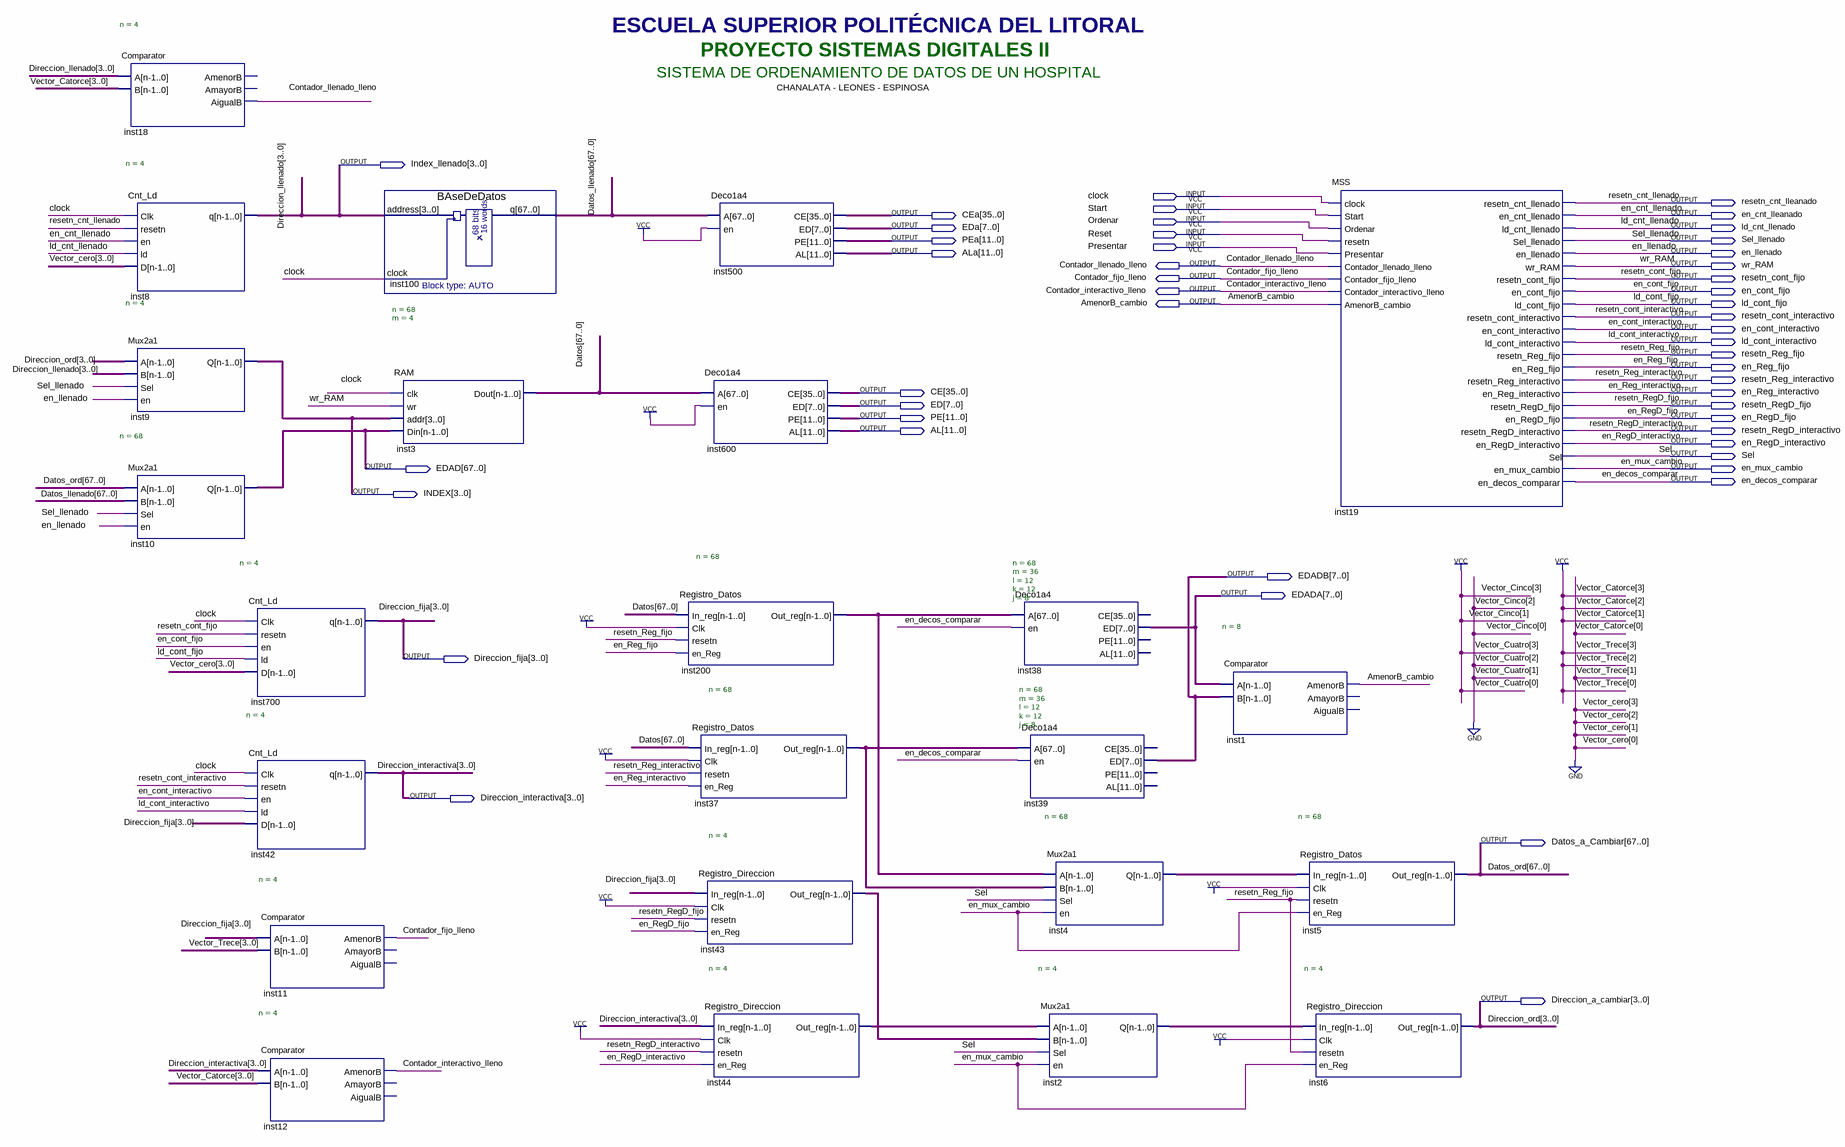
[diagram p0: schematic sheet]
// Quartus schematic PROYECTO_SD2.bdf as structural Verilog: 24 symbols, 49 pins
module PROYECTO_SD2 (
  input  clock,
  input  Start,
  input  Ordenar,
  input  Reset,
  input  Presentar,
  output [3:0] Index_llenado,
  output resetn_cnt_lleanado,
  output [35:0] CEa,
  output en_cnt_lleanado,
  output [7:0] EDa,
  output ld_cnt_llenado,
  output [11:0] PEa,
  output Sel_llenado,
  output [11:0] ALa,
  output en_llenado,
  output Contador_llenado_lleno,
  output wr_RAM,
  output Contador_fijo_lleno,
  output resetn_cont_fijo,
  output Contador_interactivo_lleno,
  output en_cont_fijo,
  output AmenorB_cambio,
  output ld_cont_fijo,
  output resetn_cont_interactivo,
  output en_cont_interactivo,
  output ld_cont_interactivo,
  output resetn_Reg_fijo,
  output en_Reg_fijo,
  output resetn_Reg_interactivo,
  output [35:0] CE,
  output en_Reg_interactivo,
  output [7:0] ED,
  output resetn_RegD_fijo,
  output [11:0] PE,
  output en_RegD_fijo,
  output [11:0] AL,
  output resetn_RegD_interactivo,
  output en_RegD_interactivo,
  output Sel,
  output [67:0] EDAD,
  output en_mux_cambio,
  output en_decos_comparar,
  output [3:0] INDEX,
  output [7:0] EDADB,
  output [7:0] EDADA,
  output [3:0] Direccion_fija,
  output [3:0] Direccion_interactiva,
  output [67:0] Datos_a_Cambiar,
  output [3:0] Direccion_a_cambiar
);

  wire [3:0] inst2_q, inst43_out_reg, inst44_out_reg;
  wire [67:0] Datos, Datos_llenado, inst4_q, inst37_out_reg, inst200_out_reg;

  Comparator #(.n(4)) inst18 (
    .A(Index_llenado), .B(4'b1110), .AigualB(Contador_llenado_lleno));  // open: AmenorB, AmayorB
  Cnt_Ld #(.n(4)) inst8 (
    .Clk(clock), .resetn(resetn_cnt_lleanado), .en(en_cnt_lleanado), .ld(ld_cnt_llenado), .D(4'b0000),
    .q(Index_llenado));
  Mux2a1 #(.n(4)) inst9 (.A(Direccion_a_cambiar), .B(Index_llenado), .Sel(Sel_llenado), .en(en_llenado), .Q(INDEX));
  Mux2a1 #(.n(68)) inst10 (.A(Datos_a_Cambiar), .B(Datos_llenado), .Sel(Sel_llenado), .en(en_llenado), .Q(EDAD));
  Cnt_Ld #(.n(4)) inst700 (
    .Clk(clock), .resetn(resetn_cont_fijo), .en(en_cont_fijo), .ld(ld_cont_fijo), .D(4'b0000),
    .q(Direccion_fija));
  Cnt_Ld #(.n(4)) inst42 (
    .Clk(clock), .resetn(resetn_cont_interactivo), .en(en_cont_interactivo), .ld(ld_cont_interactivo),
    .D(Direccion_fija), .q(Direccion_interactiva));
  Comparator #(.n(4)) inst11 (
    .A(Direccion_fija), .B(4'b1101), .AmenorB(Contador_fijo_lleno));  // open: AmayorB, AigualB
  Comparator #(.n(4)) inst12 (
    .A(Direccion_interactiva), .B(4'b1110), .AmenorB(Contador_interactivo_lleno));  // open: AmayorB, AigualB
  BAseDeDatos inst100 (.address(Index_llenado), .clock(clock), .q(Datos_llenado));
  RAM #(.n(68), .m(4)) inst3 (.clk(clock), .wr(wr_RAM), .addr(INDEX), .Din(EDAD), .Dout(Datos));
  Registro_Datos #(.n(68)) inst200 (
    .In_reg(Datos), .Clk(1'b1), .resetn(resetn_Reg_fijo), .en_Reg(en_Reg_fijo), .Out_reg(inst200_out_reg));
  Deco1a4 inst500 (.A(Datos_llenado), .en(1'b1), .CE(CEa), .ED(EDa), .PE(PEa), .AL(ALa));
  Deco1a4 inst600 (.A(Datos), .en(1'b1), .CE(CE), .ED(ED), .PE(PE), .AL(AL));
  Registro_Datos #(.n(68)) inst37 (
    .In_reg(Datos), .Clk(1'b1), .resetn(resetn_Reg_interactivo), .en_Reg(en_Reg_interactivo),
    .Out_reg(inst37_out_reg));
  Registro_Direccion #(.n(4)) inst43 (
    .In_reg(Direccion_fija), .Clk(1'b1), .resetn(resetn_RegD_fijo), .en_Reg(en_RegD_fijo),
    .Out_reg(inst43_out_reg));
  Registro_Direccion #(.n(4)) inst44 (
    .In_reg(Direccion_interactiva), .Clk(1'b1), .resetn(resetn_RegD_interactivo),
    .en_Reg(en_RegD_interactivo), .Out_reg(inst44_out_reg));
  Deco1a4 #(.n(68), .m(36), .l(12), .k(12), .j(8)) inst38 (
    .A(inst200_out_reg), .en(en_decos_comparar), .ED(EDADA));  // open: CE, PE, AL
  Deco1a4 #(.n(68), .m(36), .l(12), .k(12), .j(8)) inst39 (
    .A(inst37_out_reg), .en(en_decos_comparar), .ED(EDADB));  // open: CE, PE, AL
  Mux2a1 #(.n(68)) inst4 (.A(inst200_out_reg), .B(inst37_out_reg), .Sel(Sel), .en(en_mux_cambio), .Q(inst4_q));
  Mux2a1 #(.n(4)) inst2 (.A(inst44_out_reg), .B(inst43_out_reg), .Sel(Sel), .en(en_mux_cambio), .Q(inst2_q));
  Comparator #(.n(8)) inst1 (.A(EDADA), .B(EDADB), .AmenorB(AmenorB_cambio));  // open: AmayorB, AigualB
  MSS inst19 (
    .clock(clock), .Start(Start), .Ordenar(Ordenar), .resetn(Reset), .Presentar(Presentar),
    .Contador_llenado_lleno(Contador_llenado_lleno), .Contador_fijo_lleno(Contador_fijo_lleno),
    .Contador_interactivo_lleno(Contador_interactivo_lleno), .AmenorB_cambio(AmenorB_cambio),
    .resetn_cnt_llenado(resetn_cnt_lleanado), .en_cnt_llenado(en_cnt_lleanado),
    .ld_cnt_llenado(ld_cnt_llenado), .Sel_llenado(Sel_llenado), .en_llenado(en_llenado), .wr_RAM(wr_RAM),
    .resetn_cont_fijo(resetn_cont_fijo), .en_cont_fijo(en_cont_fijo), .ld_cont_fijo(ld_cont_fijo),
    .resetn_cont_interactivo(resetn_cont_interactivo), .en_cont_interactivo(en_cont_interactivo),
    .ld_cont_interactivo(ld_cont_interactivo), .resetn_Reg_fijo(resetn_Reg_fijo), .en_Reg_fijo(en_Reg_fijo),
    .resetn_Reg_interactivo(resetn_Reg_interactivo), .en_Reg_interactivo(en_Reg_interactivo),
    .resetn_RegD_fijo(resetn_RegD_fijo), .en_RegD_fijo(en_RegD_fijo),
    .resetn_RegD_interactivo(resetn_RegD_interactivo), .en_RegD_interactivo(en_RegD_interactivo), .Sel(Sel),
    .en_mux_cambio(en_mux_cambio), .en_decos_comparar(en_decos_comparar));
  Registro_Datos #(.n(68)) inst5 (
    .In_reg(inst4_q), .Clk(1'b1), .resetn(resetn_Reg_fijo), .en_Reg(en_mux_cambio), .Out_reg(Datos_a_Cambiar));
  Registro_Direccion #(.n(4)) inst6 (
    .In_reg(inst2_q), .Clk(1'b1), .resetn(resetn_Reg_fijo), .en_Reg(en_mux_cambio),
    .Out_reg(Direccion_a_cambiar));

  // Other names for the same wires on the sheet: Datos_ord[67:0] = Datos_a_Cambiar;
  //   Direccion_ord[3:0] = Direccion_a_cambiar; en_cnt_llenado = en_cnt_lleanado;
  //   Direccion_llenado[3:0] = Index_llenado; resetn_cnt_llenado = resetn_cnt_lleanado

  // Notes on the sheet:
  //   ESCUELA SUPERIOR POLITÉCNICA DEL LITORAL
  //   PROYECTO SISTEMAS DIGITALES II
  //   SISTEMA DE ORDENAMIENTO DE DATOS DE UN HOSPITAL
  //   CHANALATA - LEONES - ESPINOSA
endmodule
